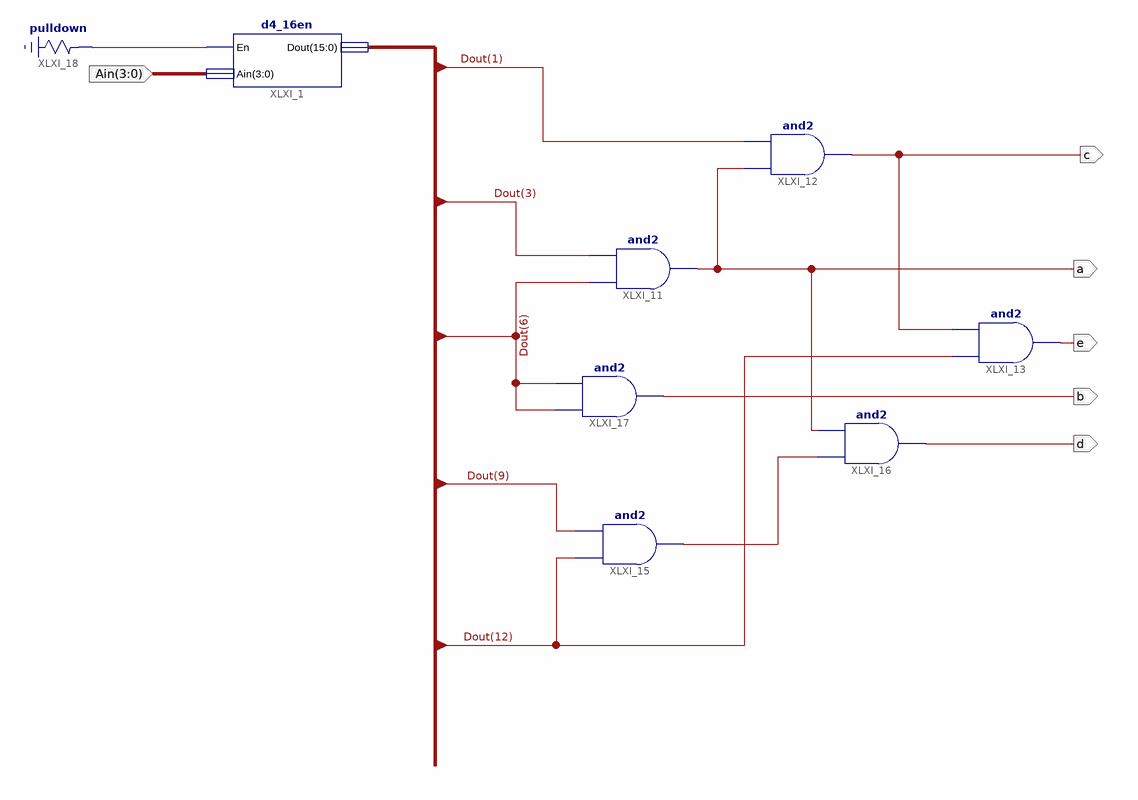
[diagram p0: schematic sheet 1]
// Xilinx ISE schematic Lab6Exp1.sch (spartan3e) as structural Verilog: 8 symbols, 6 ports
module Lab6Exp1 (
  input  [3:0] Ain,
  output c,
  output a,
  output b,
  output e,
  output d
);

  wire En, XLXN_90;
  wire [15:0] Dout;

  d4_16en XLXI_1 (.En(En), .Ain(Ain), .Dout(Dout));
  and XLXI_11 (a, Dout[6], Dout[3]);
  and XLXI_12 (c, a, Dout[1]);
  and XLXI_13 (e, Dout[12], c);
  and XLXI_15 (XLXN_90, Dout[12], Dout[9]);
  and XLXI_16 (d, XLXN_90, a);
  and XLXI_17 (b, Dout[6], Dout[6]);
  \pulldown  XLXI_18 (.O(En));
endmodule
